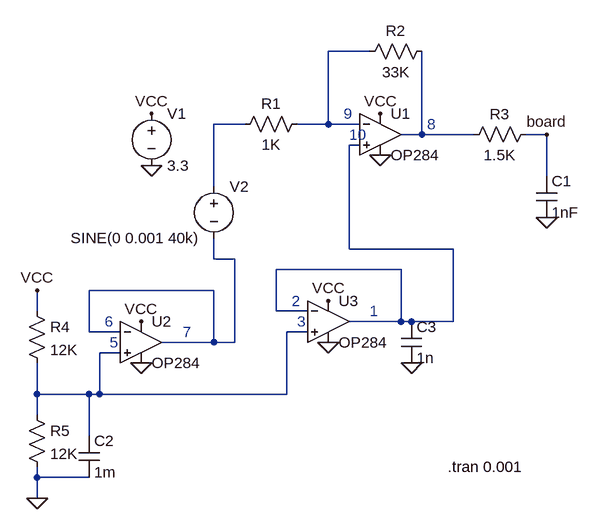
[diagram p0: schematic ReceiverCircuit.asc]
ReceiverCircuit.asc, the LTspice schematic file:
Version 4
SHEET 1 880 680
WIRE 192 -128 128 -128
WIRE 0 -16 -48 -16
WIRE 128 -16 128 -128
WIRE 128 -16 80 -16
WIRE 176 -16 128 -16
WIRE 272 0 272 -128
WIRE 272 0 240 0
WIRE 352 0 272 0
WIRE 464 0 432 0
WIRE 176 16 160 16
WIRE 464 64 464 0
WIRE -48 80 -48 -16
WIRE 160 176 160 16
WIRE 320 176 160 176
WIRE -48 192 -48 160
WIRE -16 192 -48 192
WIRE 240 208 48 208
WIRE -48 240 -240 240
WIRE -320 272 -320 240
WIRE 48 272 48 208
WIRE 96 272 48 272
WIRE 240 288 240 208
WIRE 240 288 160 288
WIRE 256 288 240 288
WIRE 320 288 320 176
WIRE 320 288 256 288
WIRE -240 304 -240 240
WIRE -192 304 -240 304
WIRE 96 304 64 304
WIRE -48 320 -48 240
WIRE -48 320 -128 320
WIRE -16 320 -16 192
WIRE -16 320 -48 320
WIRE -192 336 -224 336
WIRE -320 400 -320 352
WIRE -240 400 -320 400
WIRE -224 400 -224 336
WIRE -224 400 -240 400
WIRE 64 400 64 304
WIRE 64 400 -224 400
WIRE -320 432 -320 400
WIRE -240 464 -240 400
WIRE -320 528 -320 512
WIRE -240 528 -320 528
WIRE -320 560 -320 528
FLAG -144 48 0
FLAG -144 -32 VCC
FLAG 208 32 0
FLAG 464 128 0
FLAG -320 560 0
FLAG 208 -32 VCC
FLAG -320 240 VCC
FLAG -160 288 VCC
FLAG -160 352 0
FLAG 256 352 0
FLAG 128 256 VCC
FLAG 128 320 0
FLAG 464 0 board
SYMBOL voltage -144 -48 R0
WINDOW 123 0 0 Left 0
WINDOW 39 0 0 Left 0
SYMATTR InstName V1
SYMATTR Value 3.3
SYMBOL Opamps\\OP284 208 -64 R0
SYMATTR InstName U1
SYMBOL res 96 -32 R90
WINDOW 0 0 56 VBottom 2
WINDOW 3 32 56 VTop 2
SYMATTR InstName R1
SYMATTR Value 1K
SYMBOL res 288 -144 R90
WINDOW 0 0 56 VBottom 2
WINDOW 3 32 56 VTop 2
SYMATTR InstName R2
SYMATTR Value 33K
SYMBOL res 448 -16 R90
WINDOW 0 0 56 VBottom 2
WINDOW 3 32 56 VTop 2
SYMATTR InstName R3
SYMATTR Value 1.5K
SYMBOL cap 448 64 R0
SYMATTR InstName C1
SYMATTR Value 1nF
SYMBOL voltage -48 64 R0
WINDOW 123 0 0 Left 0
WINDOW 39 0 0 Left 0
WINDOW 3 -220 95 Left 2
SYMATTR Value SINE(0 0.001 40k)
SYMATTR InstName V2
SYMBOL cap -256 464 R0
SYMATTR InstName C2
SYMATTR Value 1m
SYMBOL res -336 256 R0
SYMATTR InstName R4
SYMATTR Value 12K
SYMBOL res -336 416 R0
SYMATTR InstName R5
SYMATTR Value 12K
SYMBOL Opamps\\OP284 -160 256 R0
SYMATTR InstName U2
SYMBOL cap 240 288 R0
SYMATTR InstName C3
SYMATTR Value 1n
SYMBOL Opamps\\OP284 128 224 R0
SYMATTR InstName U3
TEXT 312 512 Left 2 !.tran 0.001
TEXT 280 -16 Left 2 ;8
TEXT 152 -32 Left 2 ;9
TEXT 160 0 Left 2 ;10
TEXT -96 304 Left 2 ;7
TEXT -216 288 Left 2 ;6
TEXT -208 320 Left 2 ;5
TEXT 192 272 Left 2 ;1
TEXT 72 256 Left 2 ;2
TEXT 80 288 Left 2 ;3

The netlist it stands for:
* ReceiverCircuit.asc
V1 VCC 0 3.3
XU1 N004 N001 VCC 0 N003 OP284  ; pins In+ In- V+ V- OUT
R1 N001 N002 1K
R2 N003 N001 33K
R3 board N003 1.5K
C1 board 0 1nF
V2 N002 N005 SINE(0 0.001 40k)
C2 N006 0 1m
R4 VCC N006 12K
R5 N006 0 12K
XU2 N006 N005 VCC 0 N005 OP284  ; pins In+ In- V+ V- OUT
C3 N004 0 1n
XU3 N006 N004 VCC 0 N004 OP284  ; pins In+ In- V+ V- OUT
.tran 0.001
* 8
* 9
* 10
* 7
* 6
* 5
* 1
* 2
* 3
.lib ADI1.lib
.backanno
.end